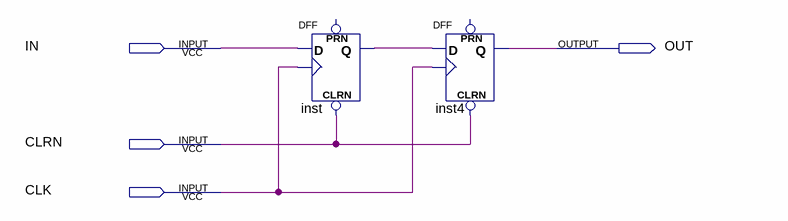
[diagram p0: schematic sheet]
// Quartus schematic delay.bdf as structural Verilog: 2 symbols, 4 pins
module delay (
  input  IN,
  input  CLRN,
  input  CLK,
  output OUT
);

  wire inst_q;

  DFF inst (.CLRN(CLRN), .CLK(CLK), .D(IN), .Q(inst_q));  // open: PRN
  DFF inst4 (.CLRN(CLRN), .CLK(CLK), .D(inst_q), .Q(OUT));  // open: PRN
endmodule
